# Altium project Def_project.PrjPCB
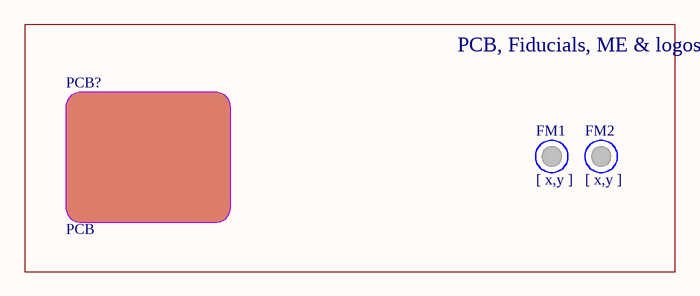
[diagram p0: Def_sch.SchDoc]
GlobalVersion: v; GlobalTPN: xxxxxx; GlobalRevision: r; GlobalReleaseDate: yyyymmdd; GlobalProjectName: projectname; GlobalFactory: pcbfactory; GlobalDrawnBy: drawnby; GlobalBoardName: boardname
1 sheet, 3 parts. Net scope: hierarchical (ports join the sheet entries above them; power ports are global).
Board file: Def_PCB.PcbDoc

## Sheet Def_sch.SchDoc: title
size A4; Date: yyyymmdd; DrawnBy: drawnby; Revision: VvRr

### Parts
FM1  [ x,y ]  [FM_40mil_2F]  (no BOM)
FM2  [ x,y ]  [FM_40mil_2F]  (no BOM)
PCB?  PCB  (mechanical)

### Blocks framed on the sheet
PCB, Fiducials, ME & logos: FM1 FM2 PCB?

### Notes on the sheet
- Title:
- Project:
- File:
- Revision:
- Date:
- Size:
- A4
- Drawn by:

### Library data of the parts
FM1 FM2 = FM_40mil_2F: Fiducial Mark 40 Mil 2 Face; Last modified by: C-D Viveros; Last modified date: 20190319
PCB? = PCB: material, thickness, plating, layers; Manufacturer: pcbfactory; Manufacturer Part Number: projectname_GRBxxxxxx_boardname_v.r; Last modified by: J.Jaramillo; Last modified date: 040726; Supplier Part Number 1: projectname_GRBxxxxxx_boardname_v.r; Supplier 1: pcbfactory